# EAGLE design usb2cmi (EAGLE 6.5.0)

## Sheet 1 of 6
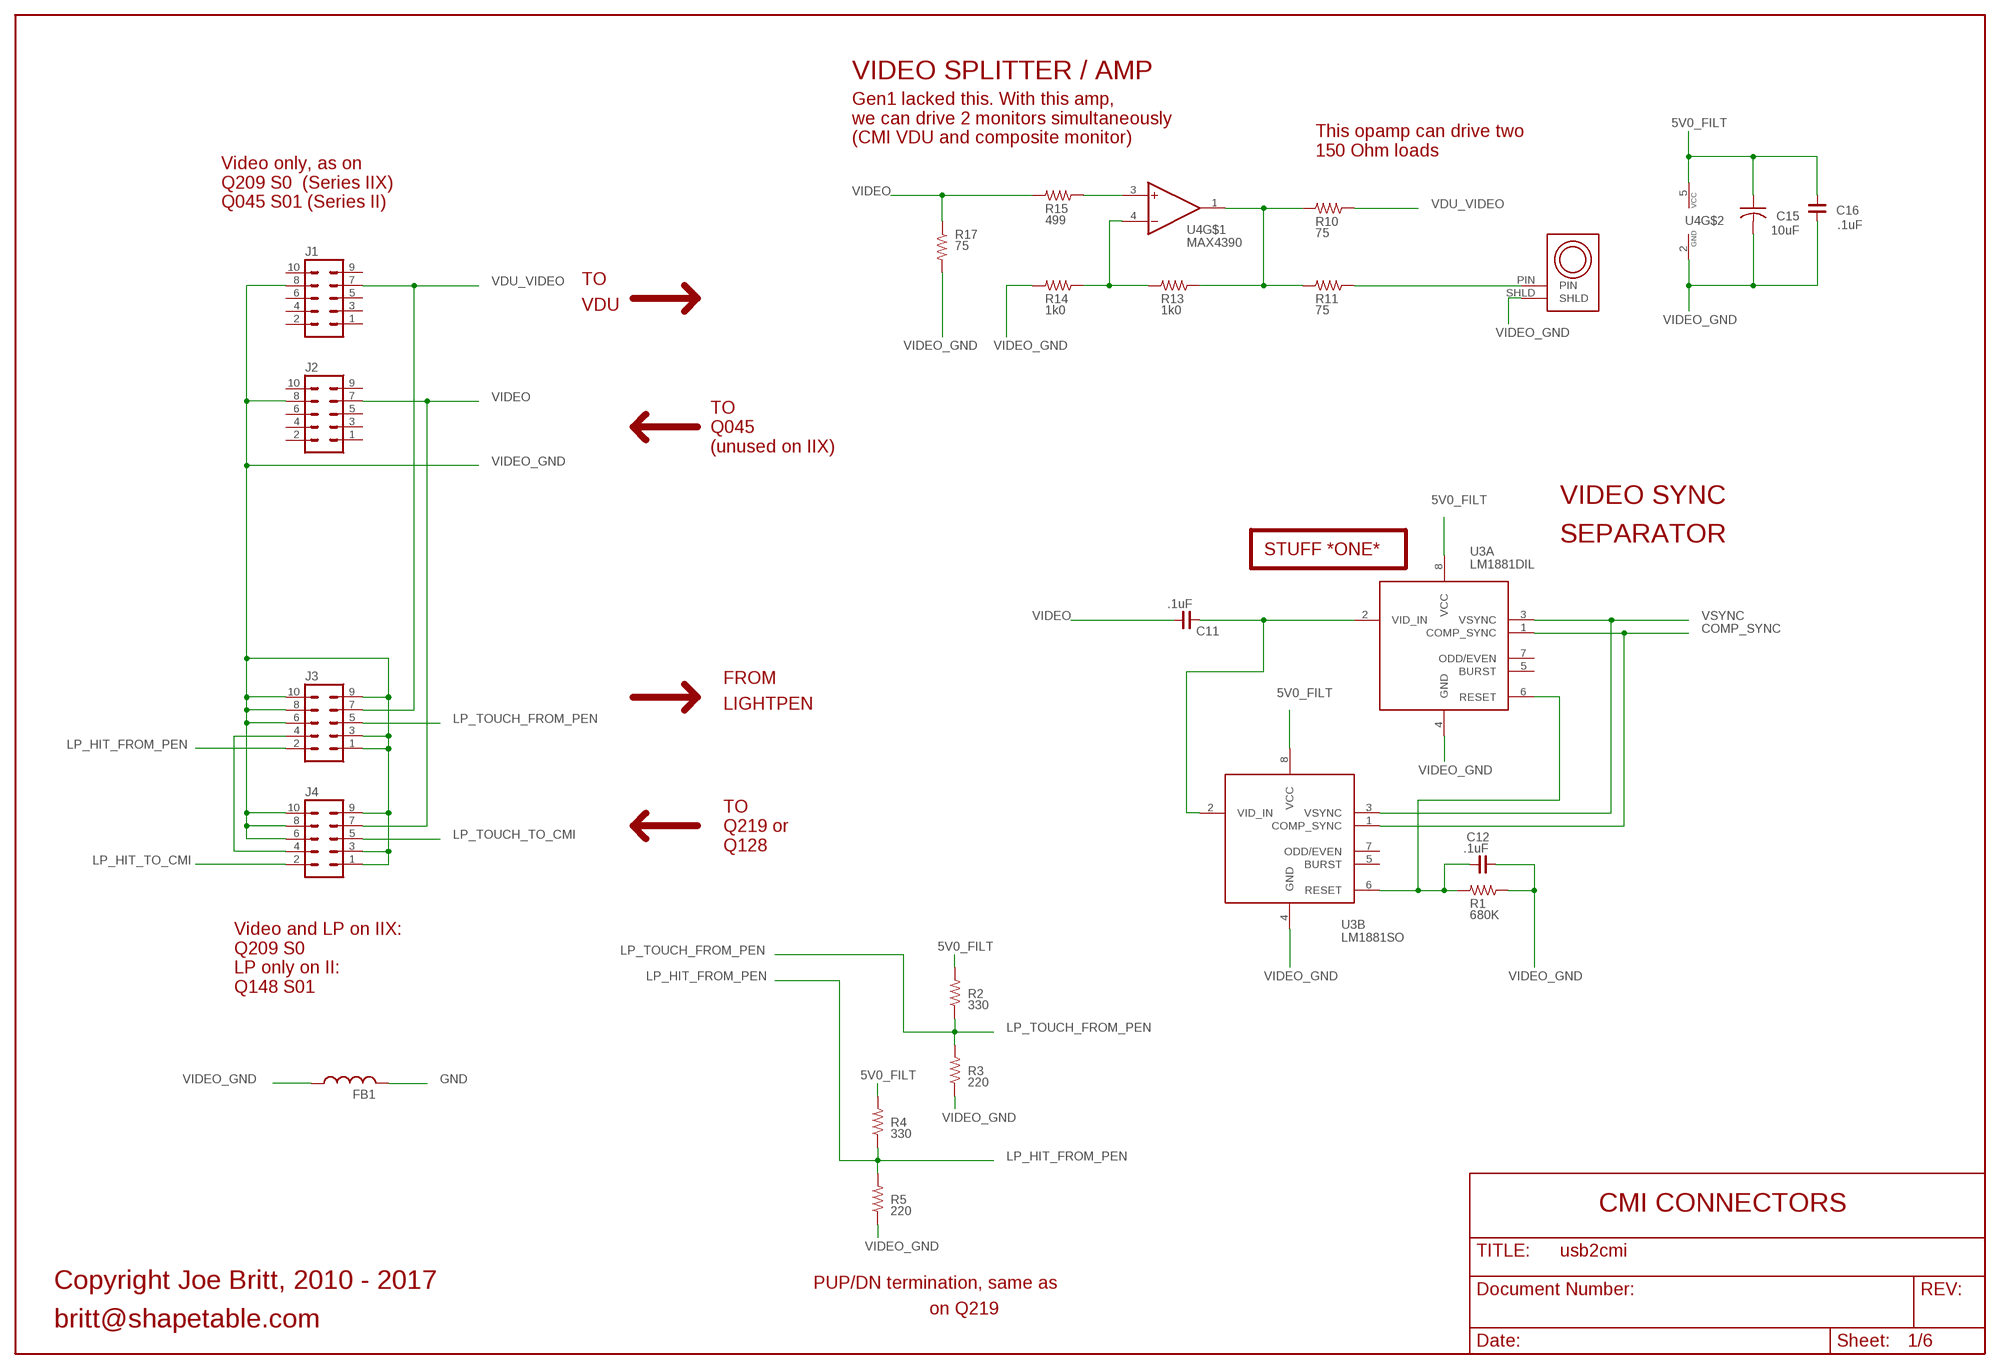
[diagram p0: schematic, sheet 1]

### Parts
C11  .1uF  C_0603  [C0603]
C12  .1uF  C_0603  [C0603]
C15  10uF  C-USC0805  [C0805]
C16  .1uF  C_0603  [C0603]
FB1  L-US0207/15  [0207/15]
J1  10H  [10H]
J2  ML10  [ML10]
J3  10H  [10H]
J4  ML10  [ML10]
J8  CUI RCJ-044  RCA-HSC  [RCA-SHIELDED]
R1  680K  R_0603  [R0603]
R2  330  R_0603  [R0603]
R3  220  R_0603  [R0603]
R4  330  R_0603  [R0603]
R5  220  R_0603  [R0603]
R10  75  R_0603  [R0603]
R11  75  R_0603  [R0603]
R13  1k0  R_0603  [R0603]
R14  1k0  R_0603  [R0603]
R15  499  R_0603  [R0603]
R17  75  R_0603  [R0603]
U3A  LM1881DIL  [DIL08]
U3B  LM1881SO  [SO08]
U4  MAX4390  [SOT23-5L]

### Nets
5V0_FILT: C15.1 C16.2 R2.2 R4.2 U3A.8(VCC) U3B.8(VCC) U4.5(VCC) ; also sheet 2,3,5,6
COMP_SYNC: U3A.1(COMP_SYNC) U3B.1(COMP_SYNC) ; also sheet 2
GND: FB1.2 ; also sheet 2,3,5,6
LP_HIT_FROM_PEN: J3.2 R4.1 R5.2 ; also sheet 2
LP_HIT_TO_CMI: J4.2 ; also sheet 2
LP_TOUCH_FROM_PEN: J3.5 R2.1 R3.2 ; also sheet 2
LP_TOUCH_TO_CMI: J4.5 ; also sheet 2
N$3: J3.4 J4.4
N$4: C11.2 U3A.2(VID_IN) U3B.2(VID_IN)
N$6: C12.1 R1.2 U3A.6(RESET) U3B.6(RESET)
N$17: R10.2 R11.2 R13.1 U4.1(OUT)
N$33: J8.PIN R11.1
N$35: R13.2 R14.1 U4.4(-IN)
N$37: R15.1 U4.3(+IN)
VDU_VIDEO: J1.7 J3.7 R10.1
VIDEO: C11.1 J2.7 J4.7 R15.2 R17.1
VIDEO_GND: C12.2 C15.2 C16.1 FB1.1 J1.8 J2.8 J3.1 J3.3 J3.6 J3.8 J3.9 J3.10 J4.1 J4.3 J4.6 J4.8 J4.9 J4.10 J8.SHLD R1.1 R3.1 R5.1 R14.2 R17.2 U3A.4(GND) U3B.4(GND) U4.2(GND) ; also sheet 3
VSYNC: U3A.3(VSYNC) U3B.3(VSYNC) ; also sheet 2
Unconnected: J1.1 J1.2 J1.3 J1.4 J1.5 J1.6 J1.9 J1.10 J2.1 J2.2 J2.3 J2.4 J2.5 J2.6 J2.9 J2.10 J8.FRM1 J8.FRM2 U3A.5(BURST) U3A.7(ODD/EVEN) U3B.5(BURST) U3B.7(ODD/EVEN)

### Notes on the sheet
- VIDEO SPLITTER / AMP
- Gen1 lacked this. With this amp,
  we can drive 2 monitors simultaneously
  (CMI VDU and composite monitor)
- This opamp can drive two
  150 Ohm loads
- Video only, as on
  Q209 S0  (Series IIX)
  Q045 S01 (Series II)
- TO
- VDU
- TO
- Q045
  (unused on IIX)
- VIDEO SYNC
- SEPARATOR
- STUFF *ONE*
- FROM
- LIGHTPEN
- TO
- Q219 or
  Q128
- Video and LP on IIX:
  Q209 S0
  LP only on II:
  Q148 S01
- CMI CONNECTORS
- Copyright Joe Britt, 2010 - 2017 | PUP/DN termination, same as
- on Q219
- britt@shapetable.com

## Sheet 2 of 6
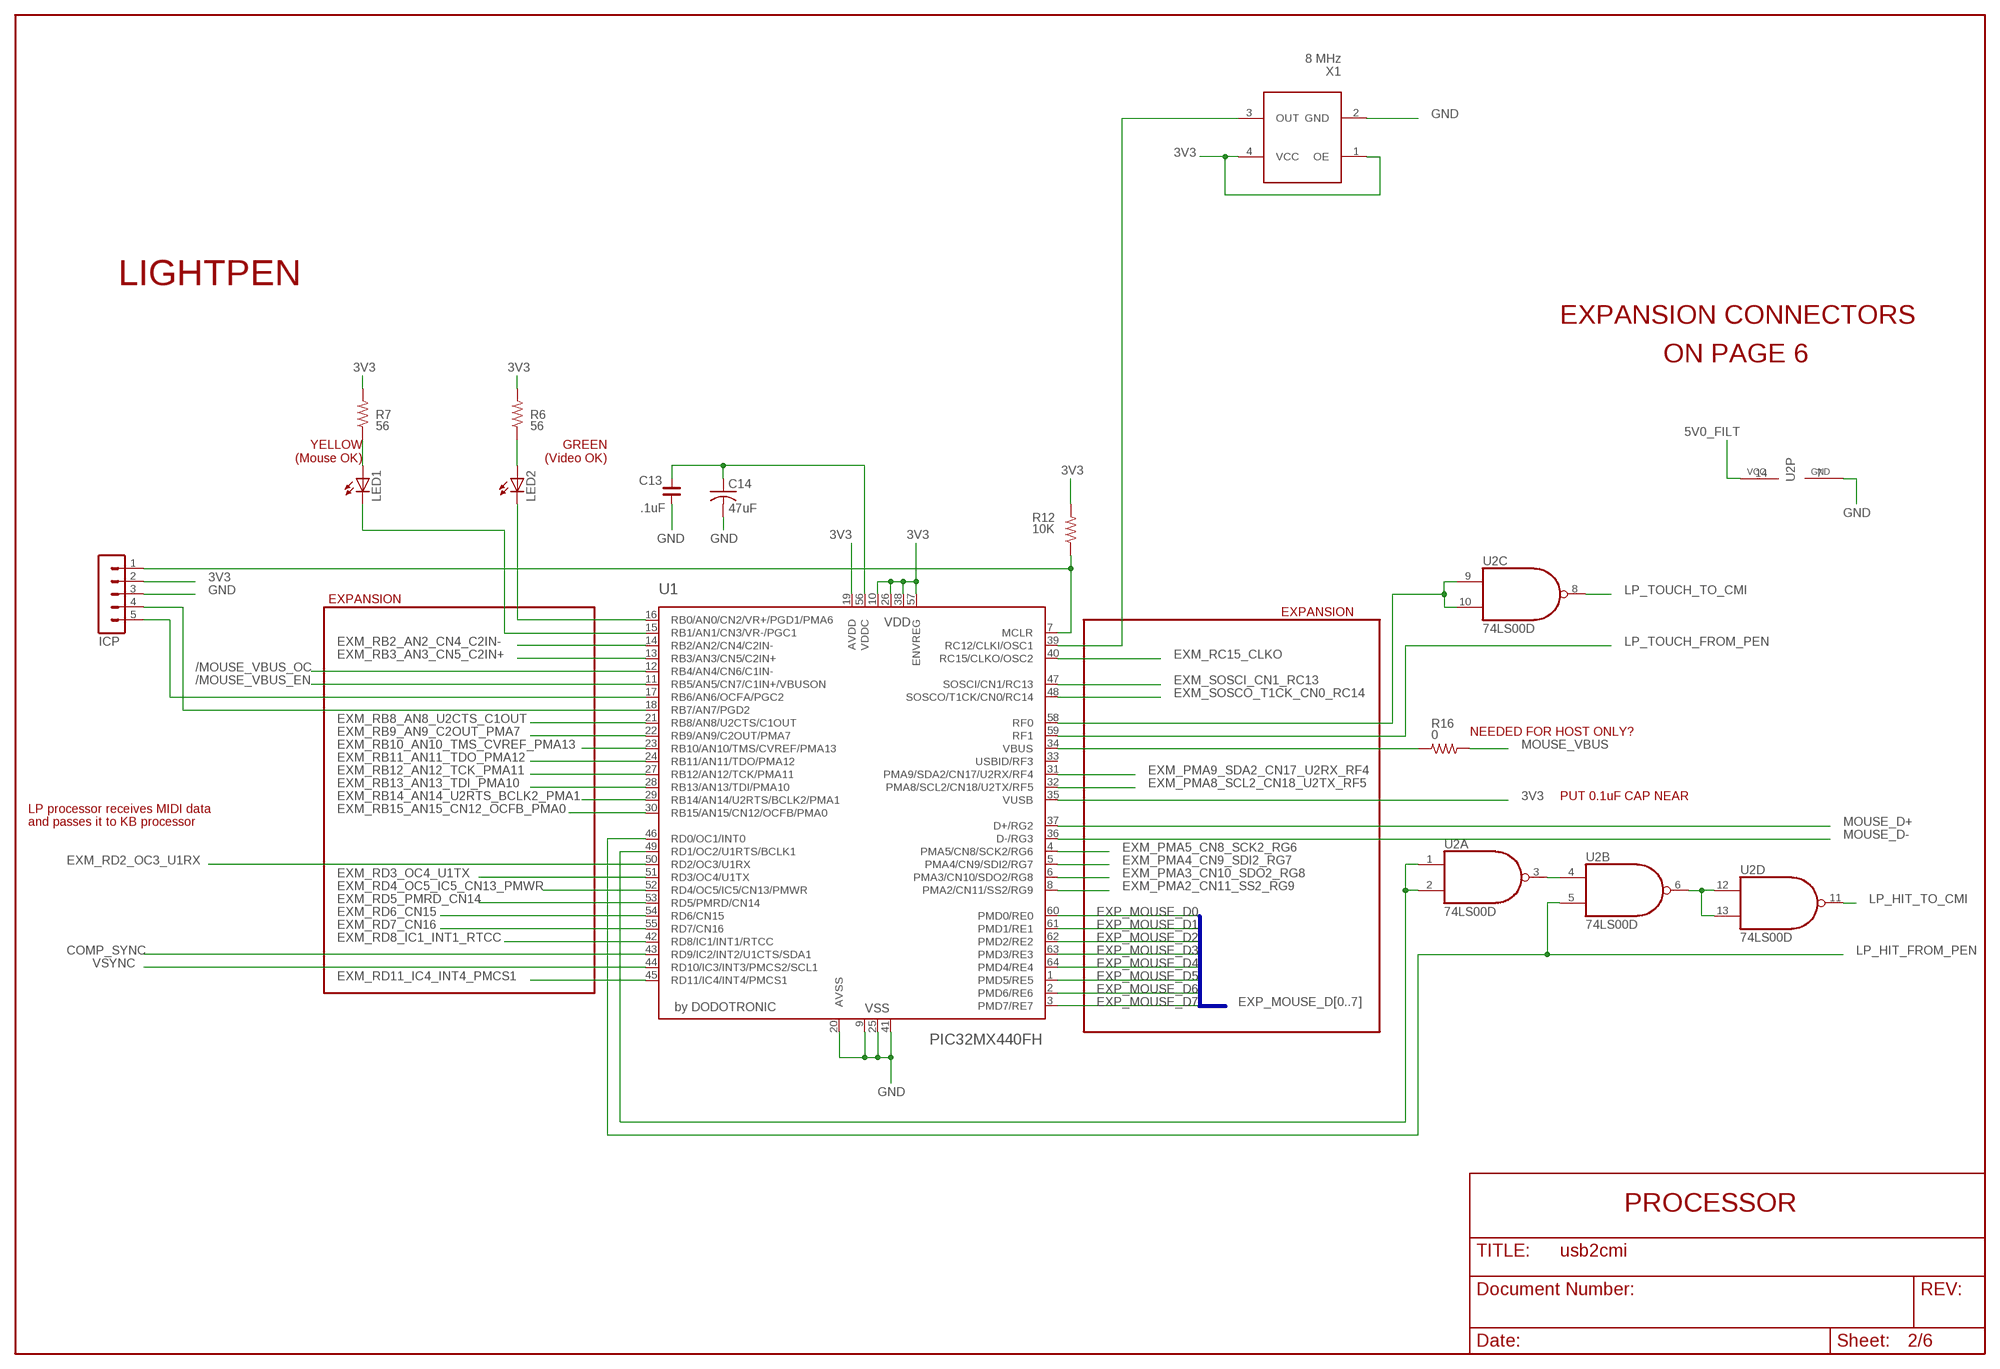
[diagram p1: schematic, sheet 2]

### Parts
C13  .1uF  C_0603  [C0603]
C14  47uF  C-USC0805  [C0805]
ICP  MA05-1  [MA05-1]
LED1  LEDCHIPLED_0805  [CHIPLED_0805]
LED2  LEDCHIPLED_0805  [CHIPLED_0805]
R6  56  R_0603  [R0603]
R7  56  R_0603  [R0603]
R12  10K  R_0603  [R0603]
R16  0  R_0603  [R0603]
U1  PIC32MX440FH  [TQFP64-10X10]
U2  74LS00D  [SO14]
X1  8 MHz  CTS-OSC  [CTS-OSC]

### Nets
3V3: ICP.2 R6.2 R7.2 R12.2 U1.10(VDD) U1.19(AVDD) U1.26(VDD) U1.35(VUSB) U1.38(VDD) U1.57(ENVREG) X1.1(OE) X1.4(VCC) ; also sheet 3
5V0_FILT: U2.14(P:VCC) ; also sheet 1,3,5,6
/MOUSE_VBUS_EN: U1.11(RB5/AN5/CN7/C1IN+/VBUSON) ; also sheet 5
/MOUSE_VBUS_OC: U1.12(RB4/AN4/CN6/C1IN-) ; also sheet 5
COMP_SYNC: U1.43(RD9/IC2/INT2/U1CTS/SDA1) ; also sheet 1
EXM_PMA2_CN11_SS2_RG9: U1.8(PMA2/CN11/SS2/RG9)
EXM_PMA3_CN10_SDO2_RG8: U1.6(PMA3/CN10/SDO2/RG8)
EXM_PMA4_CN9_SDI2_RG7: U1.5(PMA4/CN9/SDI2/RG7)
EXM_PMA5_CN8_SCK2_RG6: U1.4(PMA5/CN8/SCK2/RG6)
EXM_PMA8_SCL2_CN18_U2TX_RF5: U1.32(PMA8/SCL2/CN18/U2TX/RF5) ; also sheet 6
EXM_PMA9_SDA2_CN17_U2RX_RF4: U1.31(PMA9/SDA2/CN17/U2RX/RF4) ; also sheet 6
EXM_RB0_AN0_CN2_PMA6: LED2.C U1.16(RB0/AN0/CN2/VR+/PGD1/PMA6)
EXM_RB2_AN2_CN4_C2IN-: U1.14(RB2/AN2/CN4/C2IN-)
EXM_RB3_AN3_CN5_C2IN+: U1.13(RB3/AN3/CN5/C2IN+)
EXM_RB8_AN8_U2CTS_C1OUT: U1.21(RB8/AN8/U2CTS/C1OUT)
EXM_RB9_AN9_C2OUT_PMA7: U1.22(RB9/AN9/C2OUT/PMA7)
EXM_RB10_AN10_TMS_CVREF_PMA13: U1.23(RB10/AN10/TMS/CVREF/PMA13)
EXM_RB11_AN11_TDO_PMA12: U1.24(RB11/AN11/TDO/PMA12)
EXM_RB12_AN12_TCK_PMA11: U1.27(RB12/AN12/TCK/PMA11)
EXM_RB13_AN13_TDI_PMA10: U1.28(RB13/AN13/TDI/PMA10)
EXM_RB14_AN14_U2RTS_BCLK2_PMA1: U1.29(RB14/AN14/U2RTS/BCLK2/PMA1)
EXM_RB15_AN15_CN12_OCFB_PMA0: U1.30(RB15/AN15/CN12/OCFB/PMA0)
EXM_RC15_CLKO: U1.40(RC15/CLKO/OSC2)
EXM_RD2_OC3_U1RX: U1.50(RD2/OC3/U1RX) ; also sheet 6
EXM_RD3_OC4_U1TX: U1.51(RD3/OC4/U1TX) ; also sheet 6
EXM_RD4_OC5_IC5_CN13_PMWR: U1.52(RD4/OC5/IC5/CN13/PMWR)
EXM_RD5_PMRD_CN14: U1.53(RD5/PMRD/CN14)
EXM_RD6_CN15: U1.54(RD6/CN15)
EXM_RD7_CN16: U1.55(RD7/CN16)
EXM_RD8_IC1_INT1_RTCC: U1.42(RD8/IC1/INT1/RTCC)
EXM_RD11_IC4_INT4_PMCS1: U1.45(RD11/IC4/INT4/PMCS1)
EXM_SOSCI_CN1_RC13: U1.47(SOSCI/CN1/RC13)
EXM_SOSCO_T1CK_CN0_RC14: U1.48(SOSCO/T1CK/CN0/RC14)
EXP_MOUSE_D0: U1.60(PMD0/RE0)
EXP_MOUSE_D1: U1.61(PMD1/RE1)
EXP_MOUSE_D2: U1.62(PMD2/RE2)
EXP_MOUSE_D3: U1.63(PMD3/RE3)
EXP_MOUSE_D4: U1.64(PMD4/RE4)
EXP_MOUSE_D5: U1.1(PMD5/RE5)
EXP_MOUSE_D6: U1.2(PMD6/RE6)
EXP_MOUSE_D7: U1.3(PMD7/RE7)
GND: C13.2 C14.2 ICP.3 U1.9(VSS) U1.20(AVSS) U1.25(VSS) U1.41(VSS) U2.7(P:GND) X1.2(GND) ; also sheet 1,3,5,6
LP_HIT_FROM_PEN: U1.46(RD0/OC1/INT0) U2.5(B:I1) ; also sheet 1
LP_HIT_TO_CMI: U2.11(D:O) ; also sheet 1
LP_TOUCH_FROM_PEN: U1.59(RF1) ; also sheet 1
LP_TOUCH_TO_CMI: U2.8(C:O) ; also sheet 1
MOUSE_D+: U1.37(D+/RG2) ; also sheet 5
MOUSE_D-: U1.36(D-/RG3) ; also sheet 5
MOUSE_VBUS: R16.1 ; also sheet 5
N$1: C13.1 C14.1 U1.56(VDDC)
N$2: LED2.A R6.1
N$5: LED1.C U1.15(RB1/AN1/CN3/VR-/PGC1)
N$16: U1.39(RC12/CLKI/OSC1) X1.3(OUT)
N$27: U1.58(RF0) U2.9(C:I0) U2.10(C:I1)
N$29: U2.6(B:O) U2.12(D:I0) U2.13(D:I1)
N$30: U2.3(A:O) U2.4(B:I0)
N$31: U1.49(RD1/OC2/U1RTS/BCLK1) U2.1(A:I0) U2.2(A:I1)
N$34: LED1.A R7.1
N$36: R16.2 U1.34(VBUS)
PGC: ICP.5 U1.17(RB6/AN6/OCFA/PGC2)
PGD: ICP.4 U1.18(RB7/AN7/PGD2)
U2_MCLR: ICP.1 R12.1 U1.7(MCLR)
VSYNC: U1.44(RD10/IC3/INT3/PMCS2/SCL1) ; also sheet 1
Unconnected: U1.33(USBID/RF3)

### Buses
EXP_MOUSE_D[0..7]

### Notes on the sheet
- LIGHTPEN
- EXPANSION CONNECTORS
- ON PAGE 6
- YELLOW
  (Mouse OK)
- GREEN
  (Video OK)
- EXPANSION
- EXPANSION
- NEEDED FOR HOST ONLY?
- PUT 0.1uF CAP NEAR
- LP processor receives MIDI data
- and passes it to KB processor
- PROCESSOR

## Sheet 3 of 6
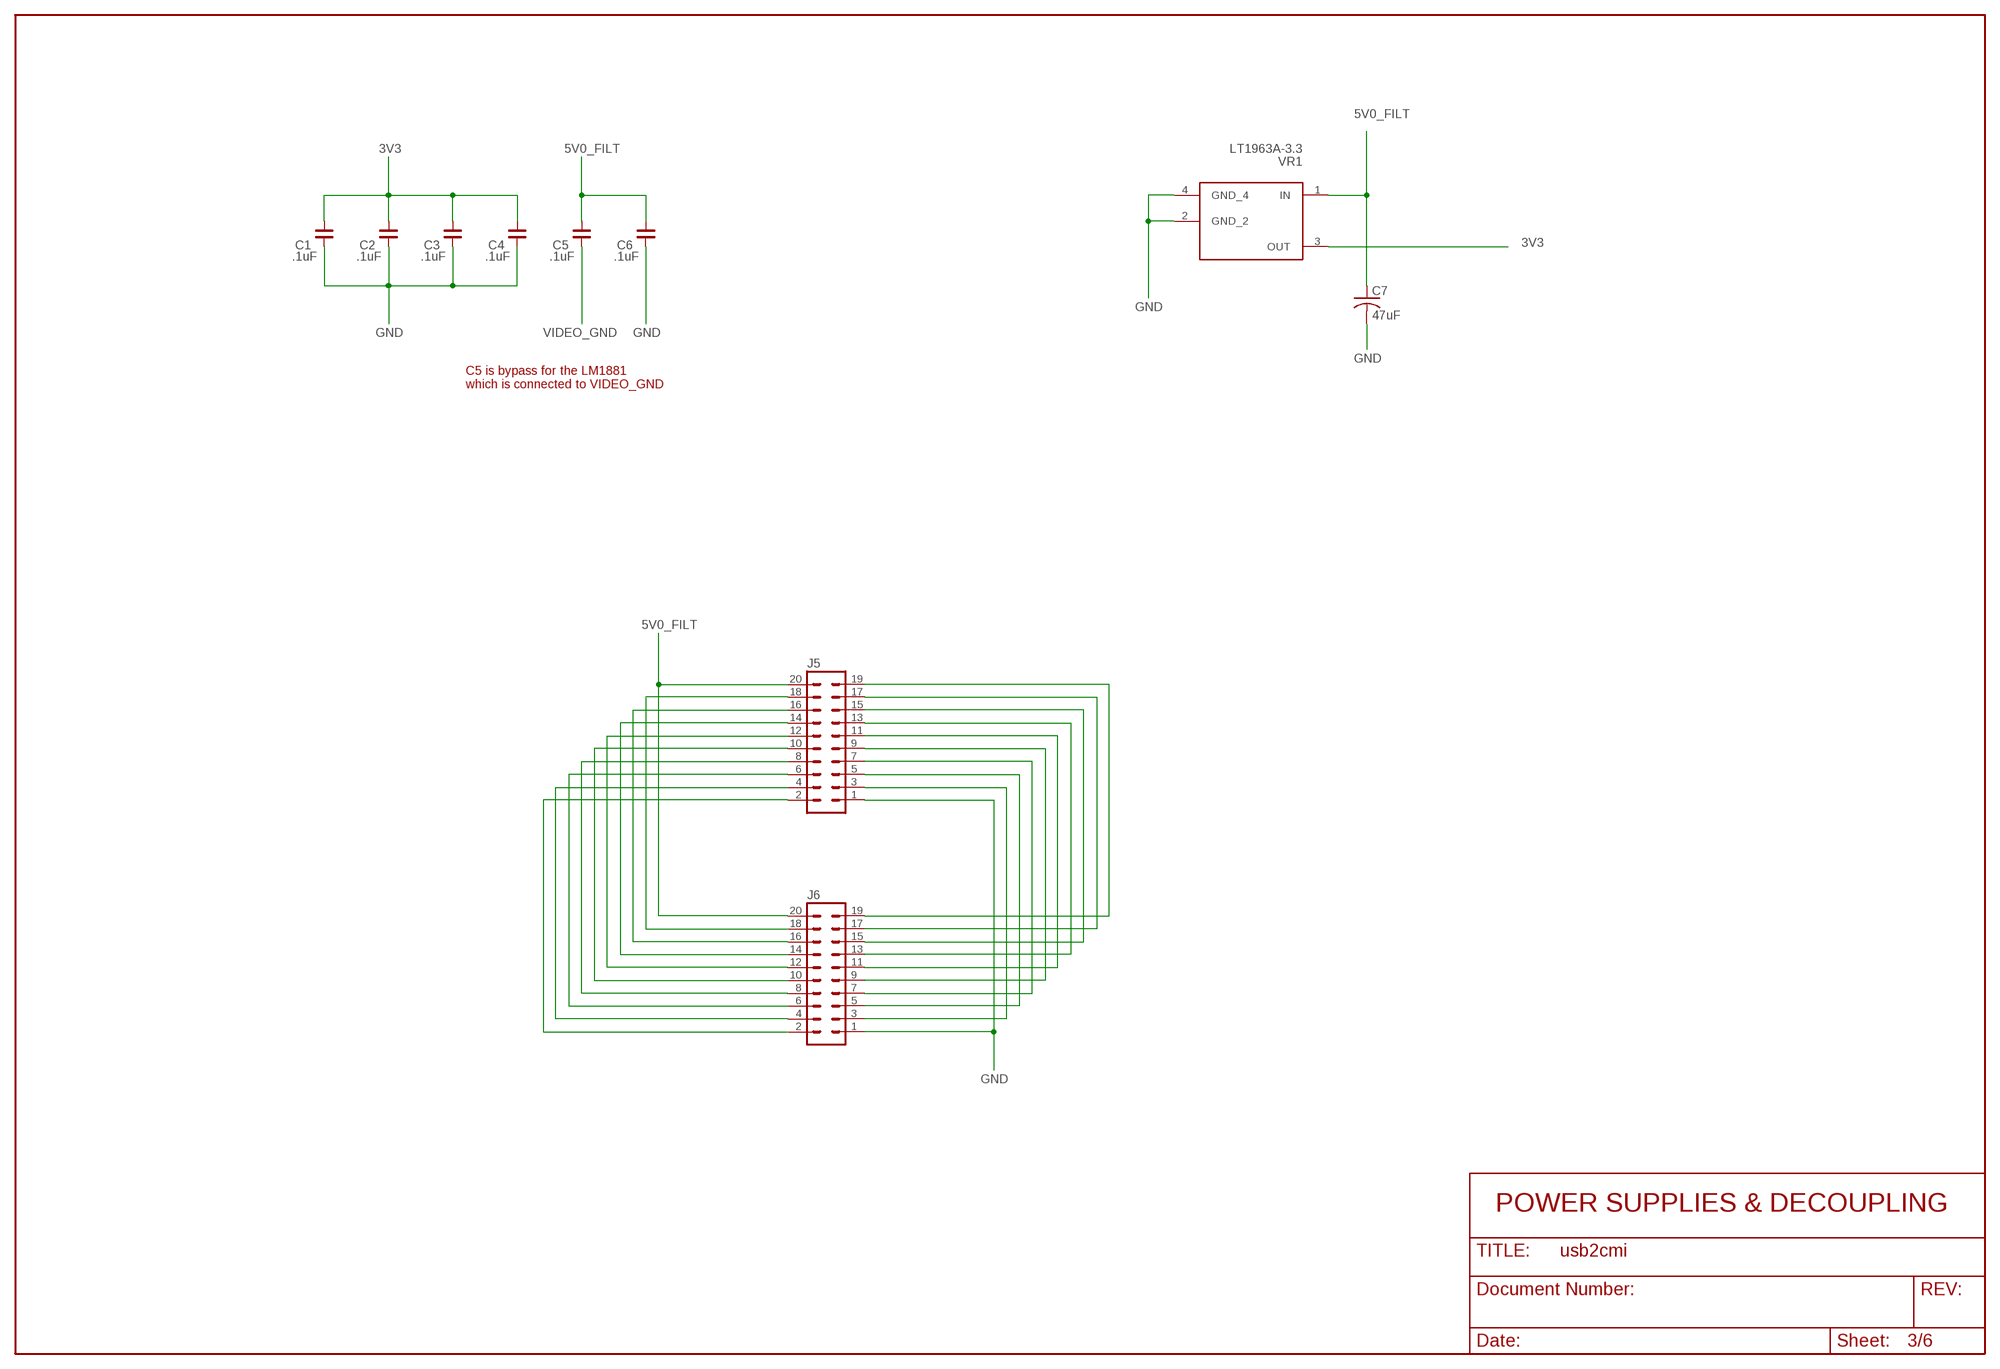
[diagram p2: schematic, sheet 3]

### Parts
C1  .1uF  C_0603  [C0603]
C2  .1uF  C_0603  [C0603]
C3  .1uF  C_0603  [C0603]
C4  .1uF  C_0603  [C0603]
C5  .1uF  C_0603  [C0603]
C6  .1uF  C_0603  [C0603]
C7  47uF  C-USC0805  [C0805]
J5  20H  [20H]
J6  ML20  [ML20]
VR1  LT1963A-3.3  LINEAR-REG-SOT223  [SOT-223]

### Nets
3V3: C1.1 C2.1 C3.1 C4.1 VR1.3(OUT) ; also sheet 2
5V0_FILT: C5.1 C6.1 C7.1 J5.20 J6.20 VR1.1(IN) ; also sheet 1,2,5,6
GND: C1.2 C2.2 C3.2 C4.2 C6.2 C7.2 J5.1 J6.1 VR1.2(GND_2) VR1.4(GND_4) ; also sheet 1,2,5,6
N$7: J5.18 J6.18
N$8: J5.16 J6.16
N$9: J5.14 J6.14
N$10: J5.12 J6.12
N$11: J5.10 J6.10
N$12: J5.8 J6.8
N$13: J5.6 J6.6
N$14: J5.4 J6.4
N$15: J5.2 J6.2
N$18: J5.3 J6.3
N$19: J5.5 J6.5
N$20: J5.7 J6.7
N$21: J5.9 J6.9
N$22: J5.11 J6.11
N$23: J5.13 J6.13
N$24: J5.15 J6.15
N$28: J5.17 J6.17
N$32: J5.19 J6.19
VIDEO_GND: C5.2 ; also sheet 1

### Notes on the sheet
- C5 is bypass for the LM1881
  which is connected to VIDEO_GND
- POWER SUPPLIES & DECOUPLING

## Sheet 4 of 6
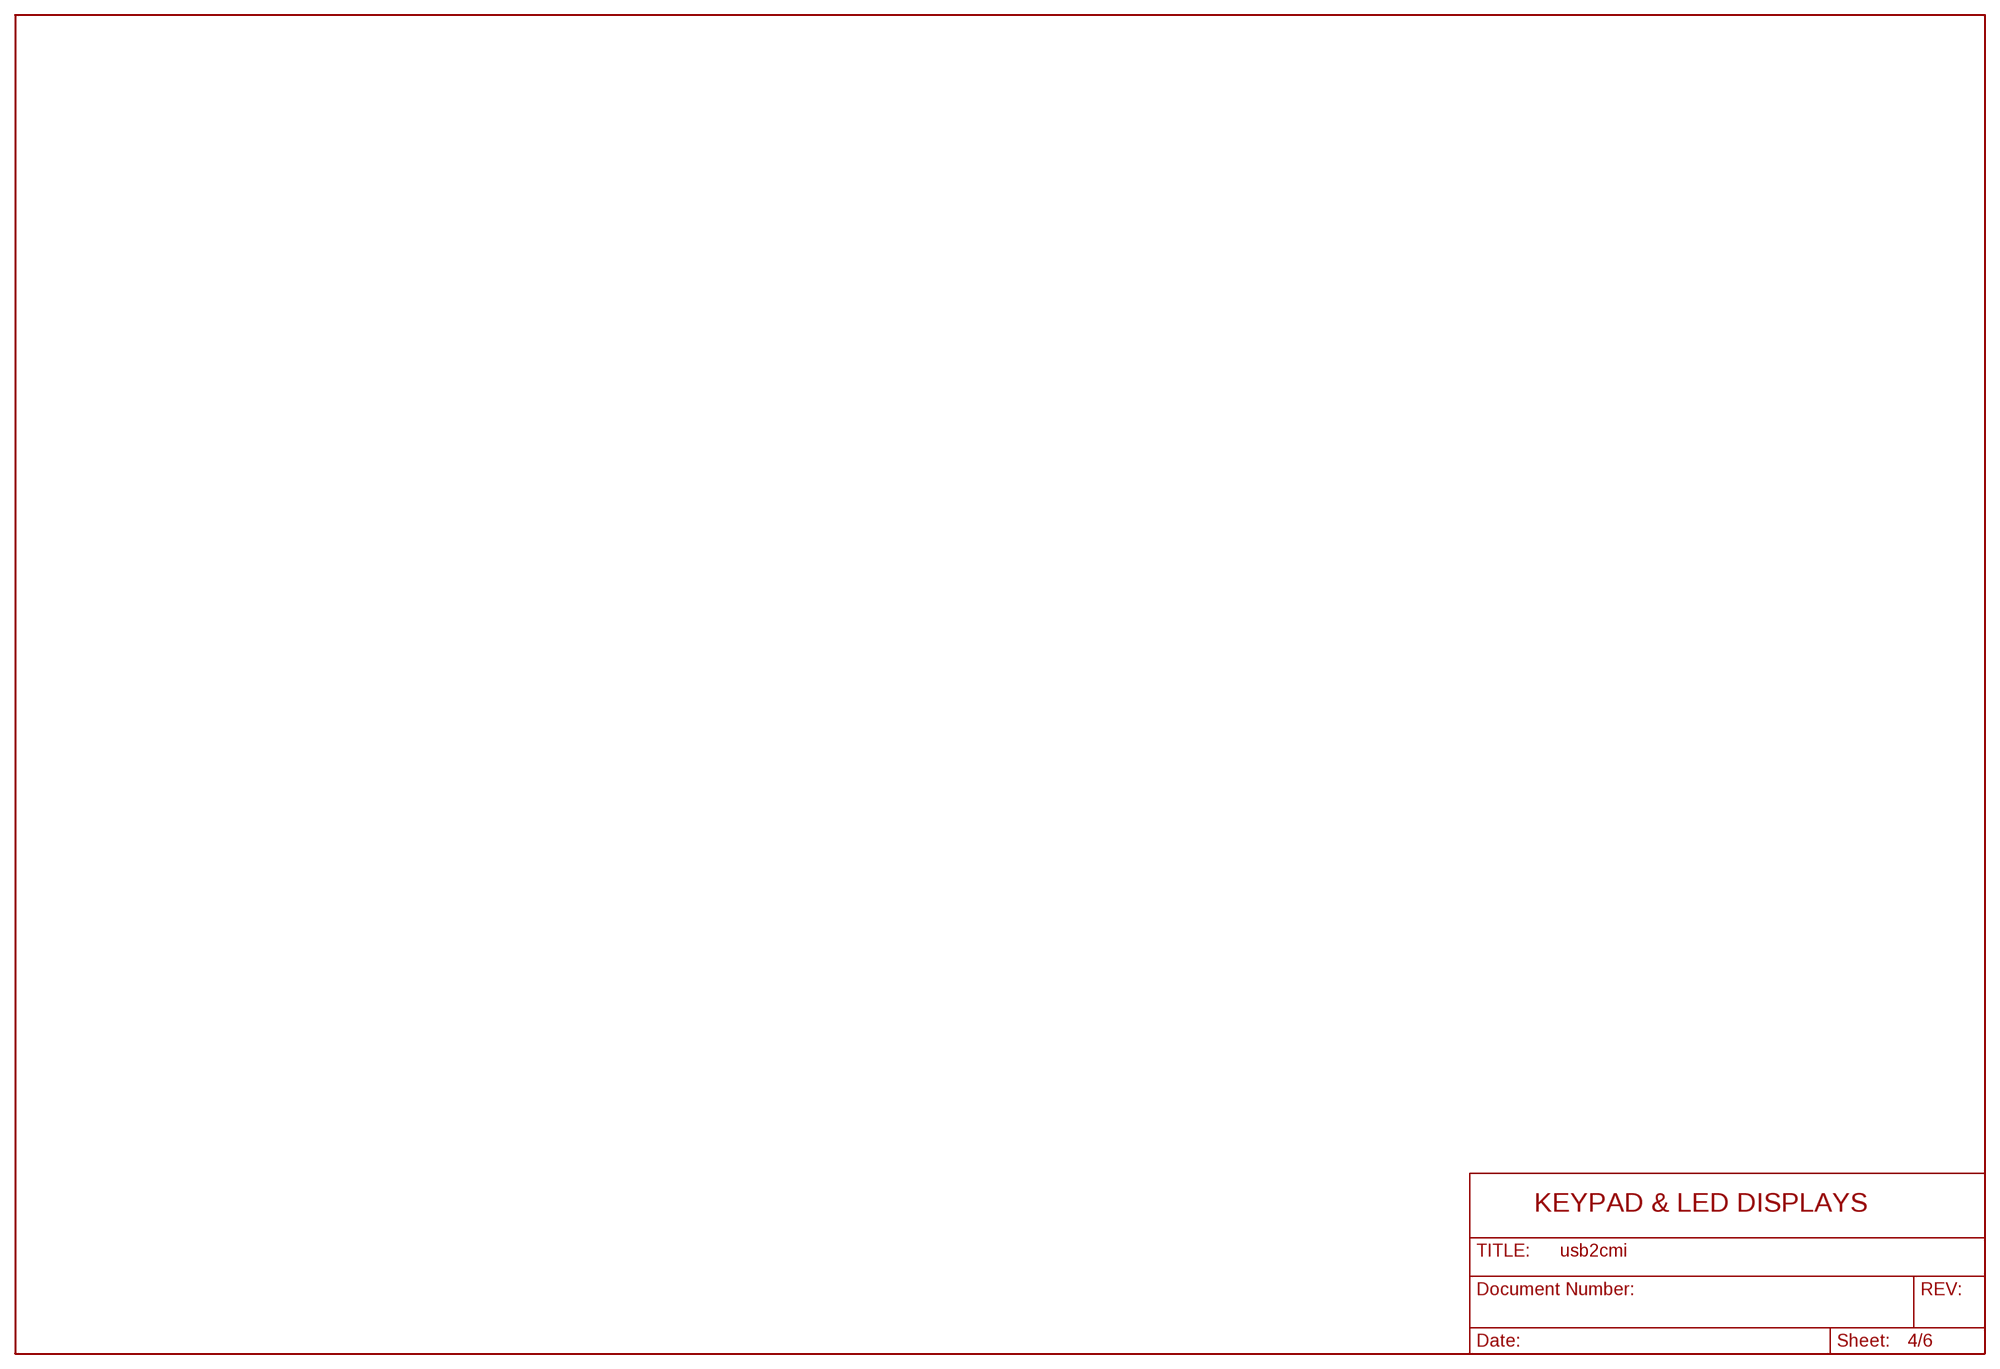
[diagram p3: schematic, sheet 4]

### Notes on the sheet
- KEYPAD & LED DISPLAYS

## Sheet 5 of 6
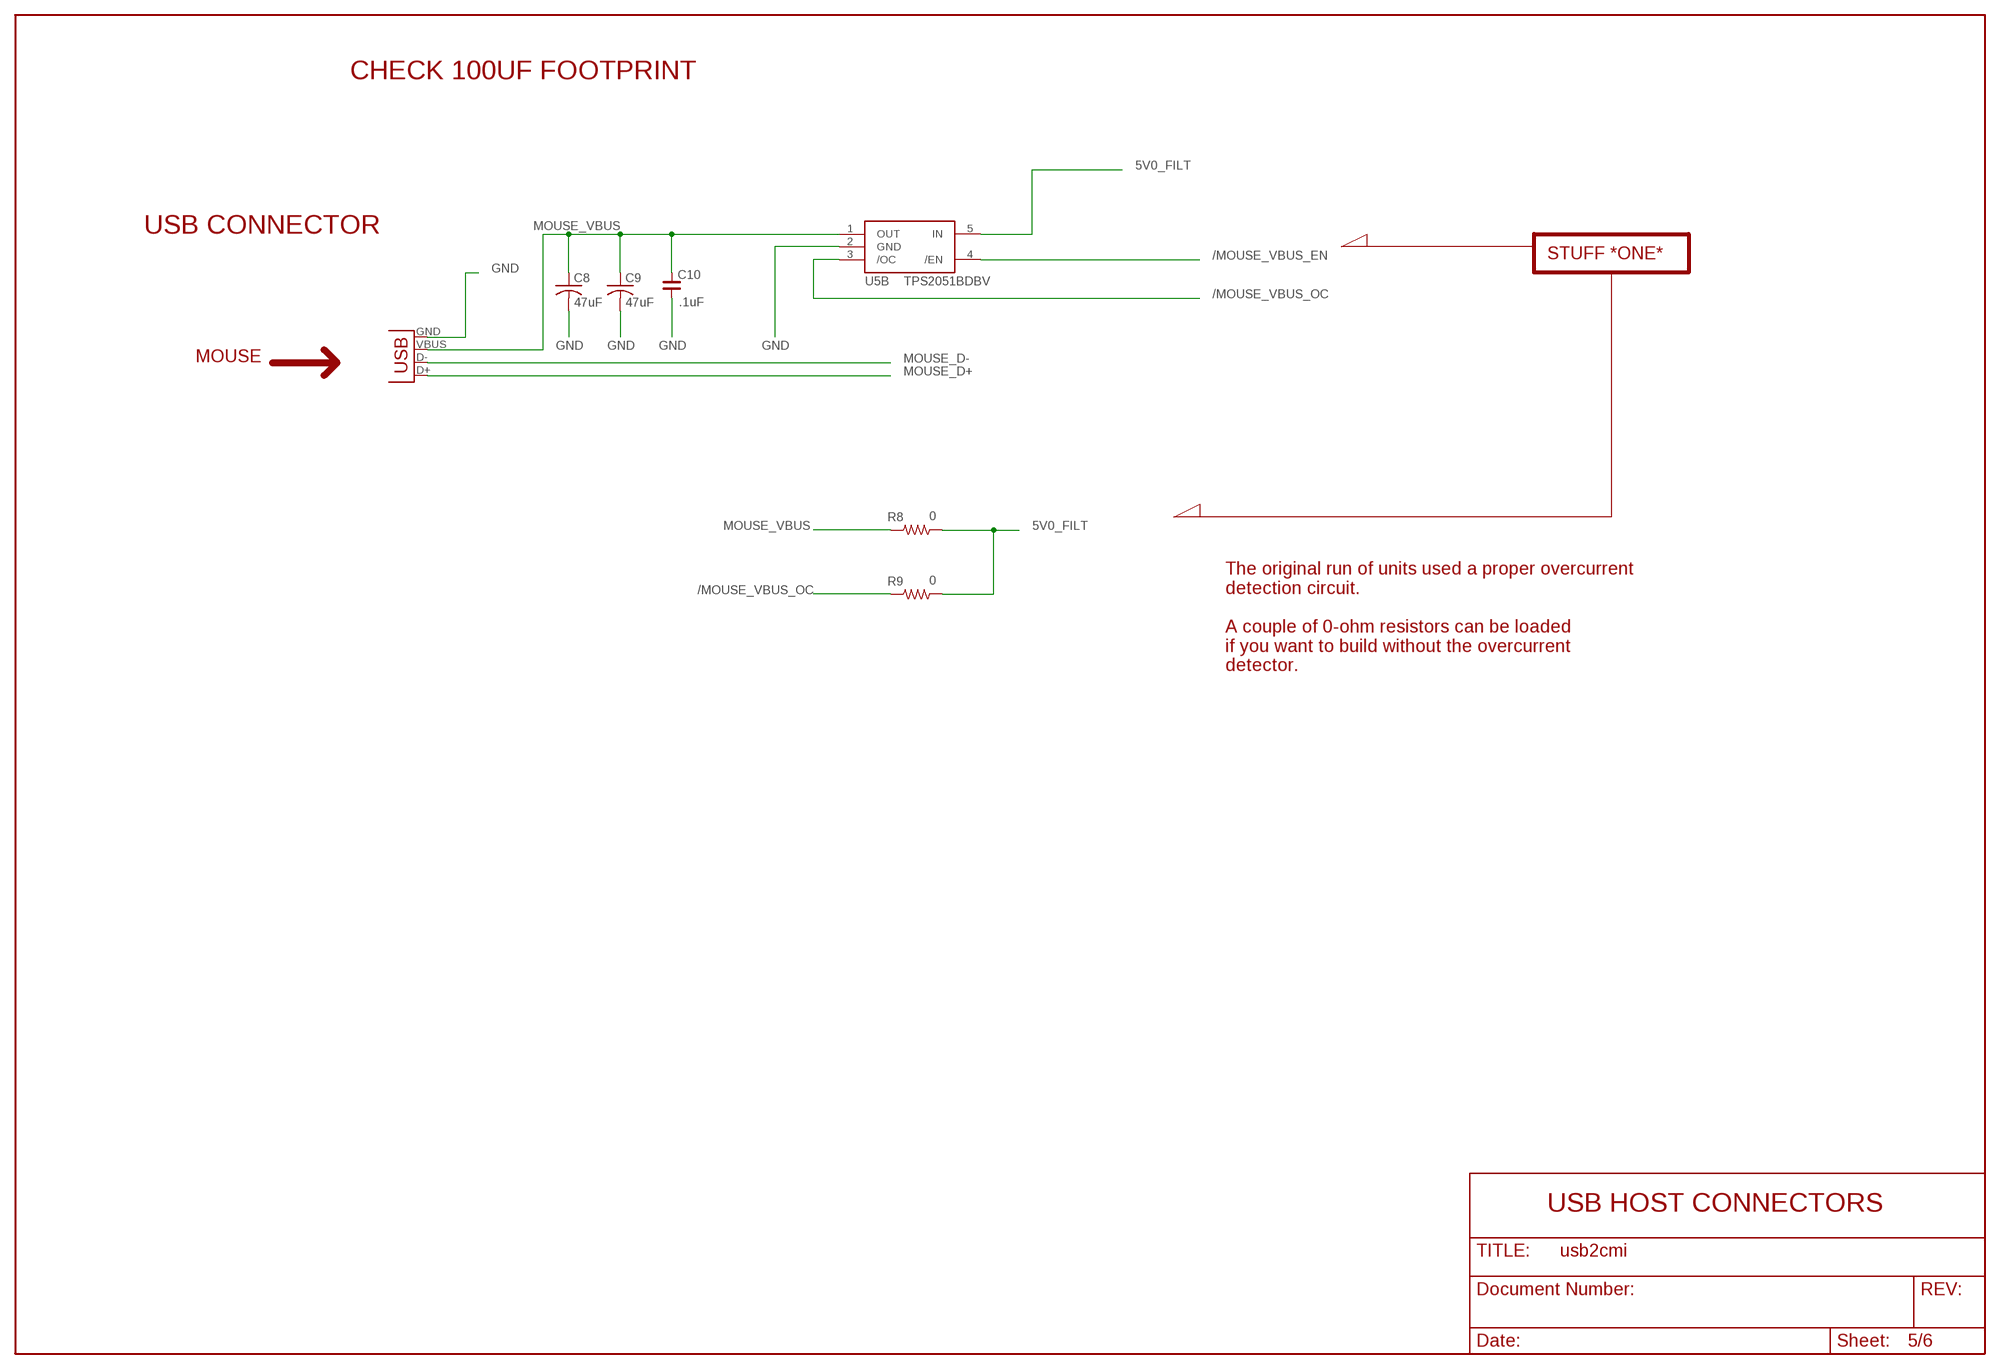
[diagram p4: schematic, sheet 5]

### Parts
C8  47uF  C-USC0805  [C0805]
C9  47uF  C-USC0805  [C0805]
C10  .1uF  C_0603  [C0603]
J7  USB-A-H  [USB-A-H]
R8  0  R_0603  [R0603]
R9  0  R_0603  [R0603]
U5B  TPS2051BDBV  TPS2041BDBV  [DBV-5]

### Nets
5V0_FILT: R8.1 R9.1 U5B.5(IN) ; also sheet 1,2,3,6
/MOUSE_VBUS_EN: U5B.4(/EN) ; also sheet 2
/MOUSE_VBUS_OC: R9.2 U5B.3(/OC) ; also sheet 2
GND: C8.2 C9.2 C10.2 J7.GND U5B.2(GND) ; also sheet 1,2,3,6
MOUSE_D+: J7.D+ ; also sheet 2
MOUSE_D-: J7.D- ; also sheet 2
MOUSE_VBUS: C8.1 C9.1 C10.1 J7.VBUS R8.2 U5B.1(OUT) ; also sheet 2

### Notes on the sheet
- CHECK 100UF FOOTPRINT
- USB CONNECTOR
- STUFF *ONE*
- MOUSE
- The original run of units used a proper overcurrent
  detection circuit.
  
  A couple of 0-ohm resistors can be loaded
  if you want to build without the overcurrent
  detector.
- USB HOST CONNECTORS

## Sheet 6 of 6
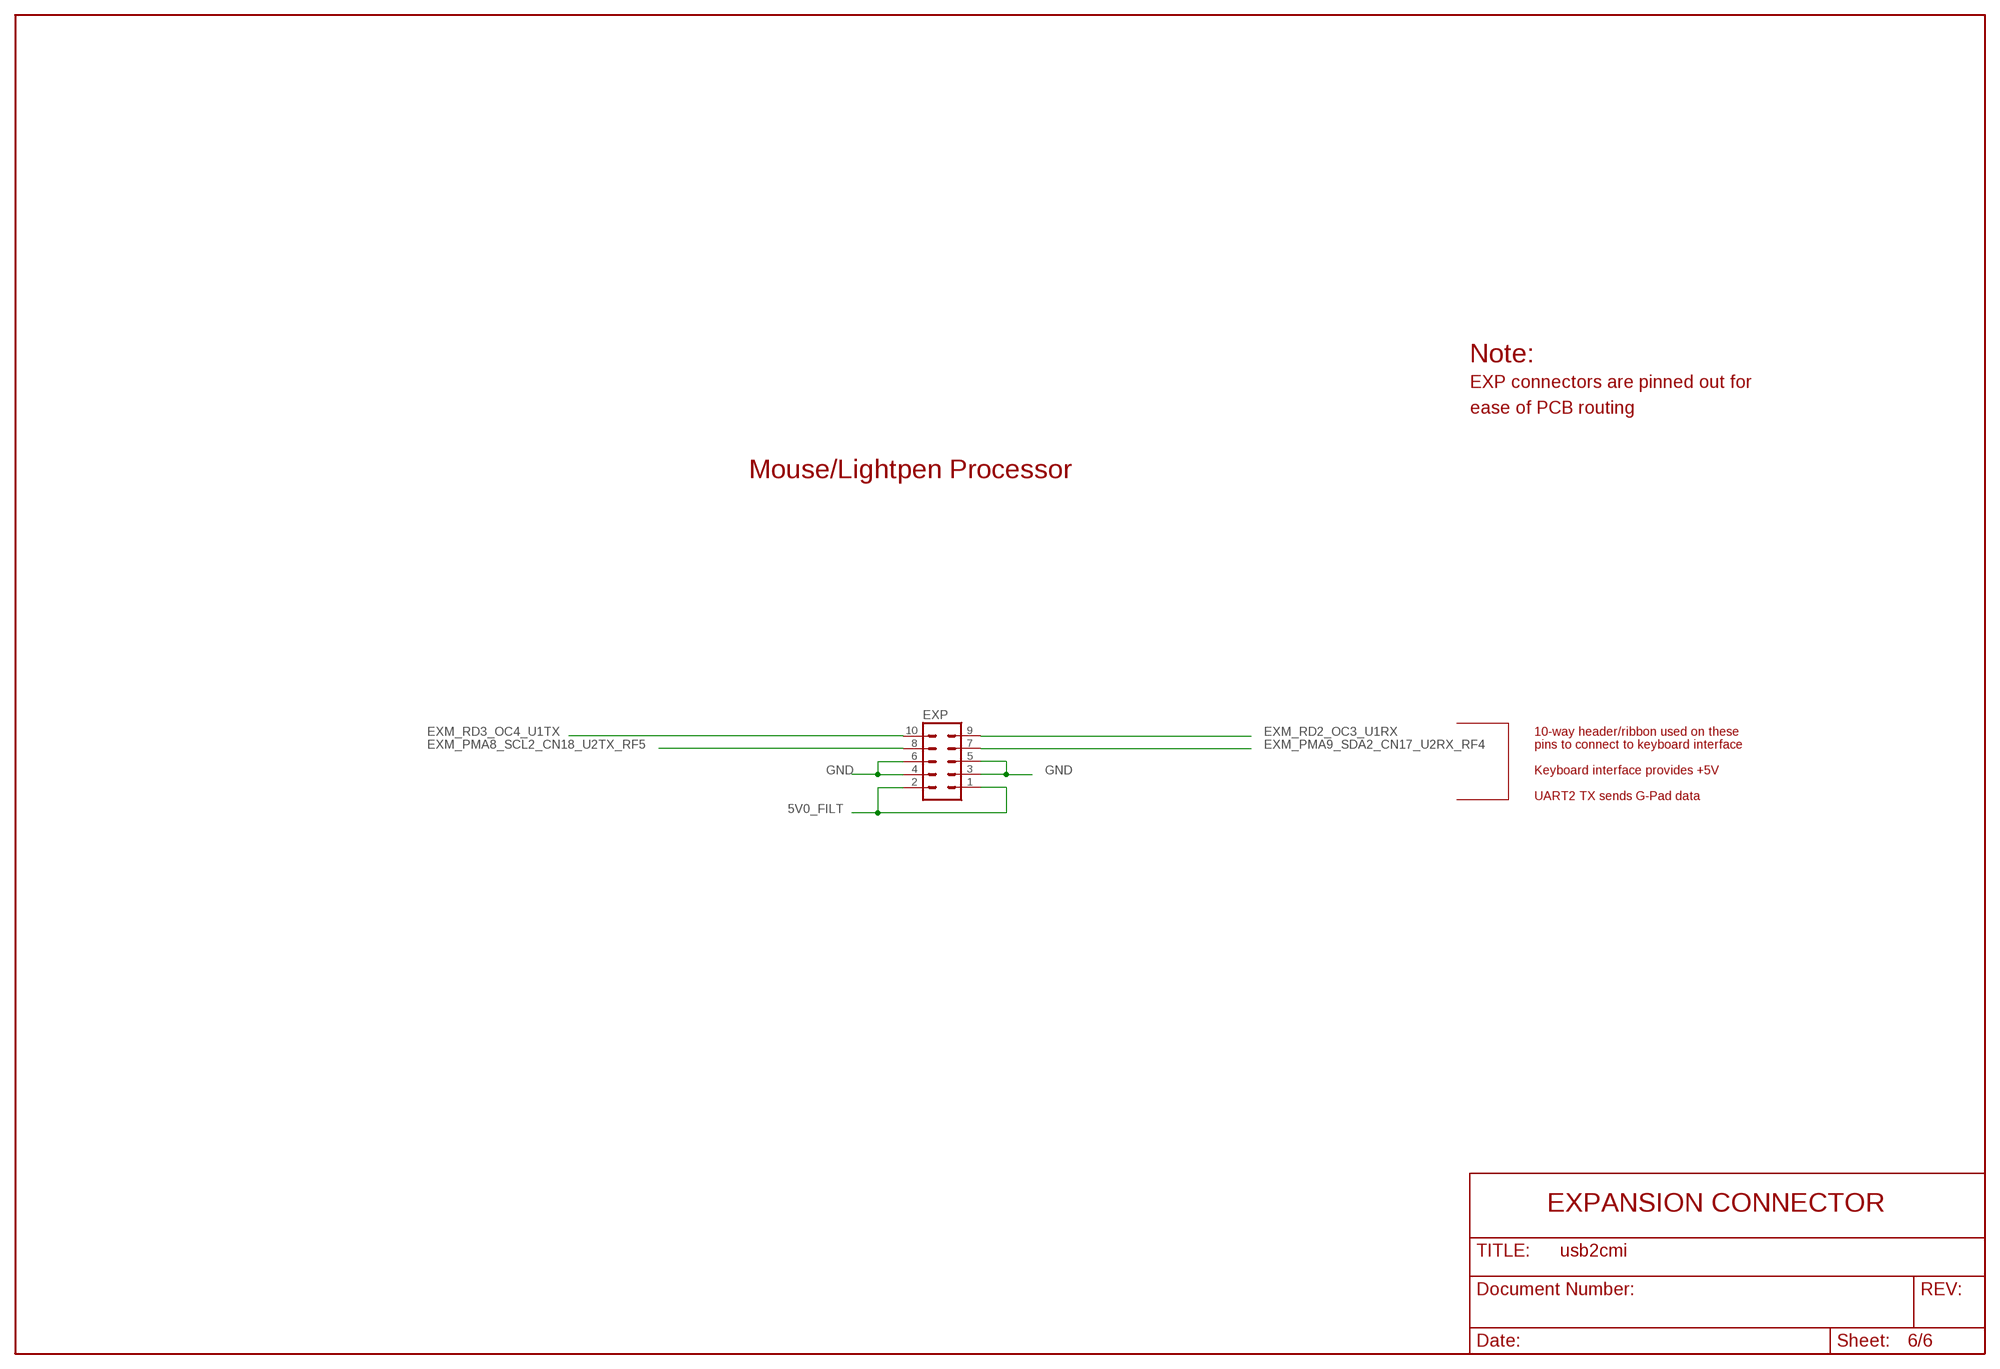
[diagram p5: schematic, sheet 6]

### Parts
EXP  MA05-2  [MA05-2]

### Nets
5V0_FILT: EXP.1 EXP.2 ; also sheet 1,2,3,5
EXM_PMA8_SCL2_CN18_U2TX_RF5: EXP.8 ; also sheet 2
EXM_PMA9_SDA2_CN17_U2RX_RF4: EXP.7 ; also sheet 2
EXM_RD2_OC3_U1RX: EXP.9 ; also sheet 2
EXM_RD3_OC4_U1TX: EXP.10 ; also sheet 2
GND: EXP.3 EXP.4 EXP.5 EXP.6 ; also sheet 1,2,3,5

### Notes on the sheet
- Note:
- EXP connectors are pinned out for
- ease of PCB routing
- Mouse/Lightpen Processor
- 10-way header/ribbon used on these
- pins to connect to keyboard interface
- Keyboard interface provides +5V
- UART2 TX sends G-Pad data
- EXPANSION CONNECTOR

## Library data of the parts
C1-C6 C10-C13 C16 = rc-master-smd:C_: NON-POLARIZED CAP
C7-C9 C14 C15 = rcl:C-US: CAPACITOR, American symbol
EXP = con-lstb:MA05-2: PIN HEADER; OC_FARNELL: unknown; OC_NEWARK: unknown
FB1 = rcl:L-US: INDUCTOR, American symbol
ICP = con-lstb:MA05-1: PIN HEADER; OC_FARNELL: unknown; OC_NEWARK: unknown
J1 J3 = con-harting-h:10H: CONNECTOR; OC_FARNELL: unknown; OC_NEWARK: unknown
J2 J4 = con-harting-ml:ML10: HARTING; OC_FARNELL: unknown; OC_NEWARK: unknown
J5 = con-harting-h:20H: CONNECTOR; OC_FARNELL: unknown; OC_NEWARK: unknown
J6 = con-harting-ml:ML20: HARTING; OC_FARNELL: unknown; OC_NEWARK: unknown
J7 = con-usb (1):USB: USB Connectors
J8 = con-rca-hsc:RCA-HSC
LED1 LED2 = led:LED: LED OSRAM: - CHIPLED LG R971, LG N971, LY N971, LG Q971, LY Q971, LO R971, LY R971 LH N974, LH R974 LS Q976, LO Q976, LY Q976 LO Q996 - Hyper CHIPLED LW Q18S LB Q993, LB Q99A, LB R99A - SideLED LS A670, LO A670, LY A670, LG A670, LP A670 LB A673, LV A673, LT A673, LW A673 LH A674 LY A675 LS A676, LA A676, LO A676, LY A676, LW A676 LS A679, LY A679, LG A679 - Hyper Micro SIDELED® LS Y876, LA Y876, LO Y876, LY Y876 LT Y87S - SmartLED LW L88C, LW L88S LB L89C, LB L89S, LG L890 LS L89K, LO L89K, LY L89K LS L896, LA L896, LO L896, LY L896 - TOPLED LS T670, LO T670, LY T670, LG T670, LP T670 LSG T670, LSP T670, LSY T670, LOP T670, LYG T670 LG T671, LOG T671, LSG T671 LB T673, LV T673, LT T673, LW T673 LH T674 LS T676, LA T676, LO T676, LY T676, LB T676, LH T676, LSB T676, LW T676 LB T67C, LV T67C, LT T67C, LS T67K, LO T67K, LY T67K, LW E67C LS E67B, LA E67B, LO E67B, LY E67B, LB E67C, LV E67C, LT E67C LW T67C LS T679, LY T679, LG T679 LS T770, LO T770, LY T770, LG T770, LP T770 LB T773, LV T773, LT T773, LW T773 LH T774 LS E675, LA E675, LY E675, LS T675 LS T776, LA T776, LO T776, LY T776, LB T776 LHGB T686 LT T68C, LB T68C - Hyper Mini TOPLED® LB M676 - Mini TOPLED Santana® LG M470 LS M47K, LO M47K, LY M47K Source: http://www.osram.convergy.de LUXEON: - LUMILED® LXK2-PW12-R00, LXK2-PW12-S00, LXK2-PW14-U00, LXK2-PW14-V00 LXK2-PM12-R00, LXK2-PM12-S00, LXK2-PM14-U00 LXK2-PE12-Q00, LXK2-PE12-R00, LXK2-PE12-S00, LXK2-PE14-T00, LXK2-PE14-U00 LXK2-PB12-K00, LXK2-PB12-L00, LXK2-PB12-M00, LXK2-PB14-N00, LXK2-PB14-P00, LXK2-PB14-Q00 LXK2-PR12-L00, LXK2-PR12-M00, LXK2-PR14-Q00, LXK2-PR14-R00 LXK2-PD12-Q00, LXK2-PD12-R00, LXK2-PD12-S00 LXK2-PH12-R00, LXK2-PH12-S00 LXK2-PL12-P00, LXK2-PL12-Q00, LXK2-PL12-R00 Source: www.luxeon.com KINGBRIGHT: KA-3528ASYC Source: www.kingbright.com; DKPN: 516-1429-1-ND
R1-R17 = rc-master-smd:R_: RESISTOR
U1 = DodoMicroR3:PIC32MX440F*H: Microchip PIC32 USB
U2 = 74xx-us:74*00: Quad 2-input NAND gate
U3A U3B = ns-linear:LM1881
U4 = maxim-10:MAX4390
U5B = TPS2041:TPS2041BDBV
VR1 = power:LINEAR-REG-SOT223
X1 = Nintendo:CTS-OSC

## Board
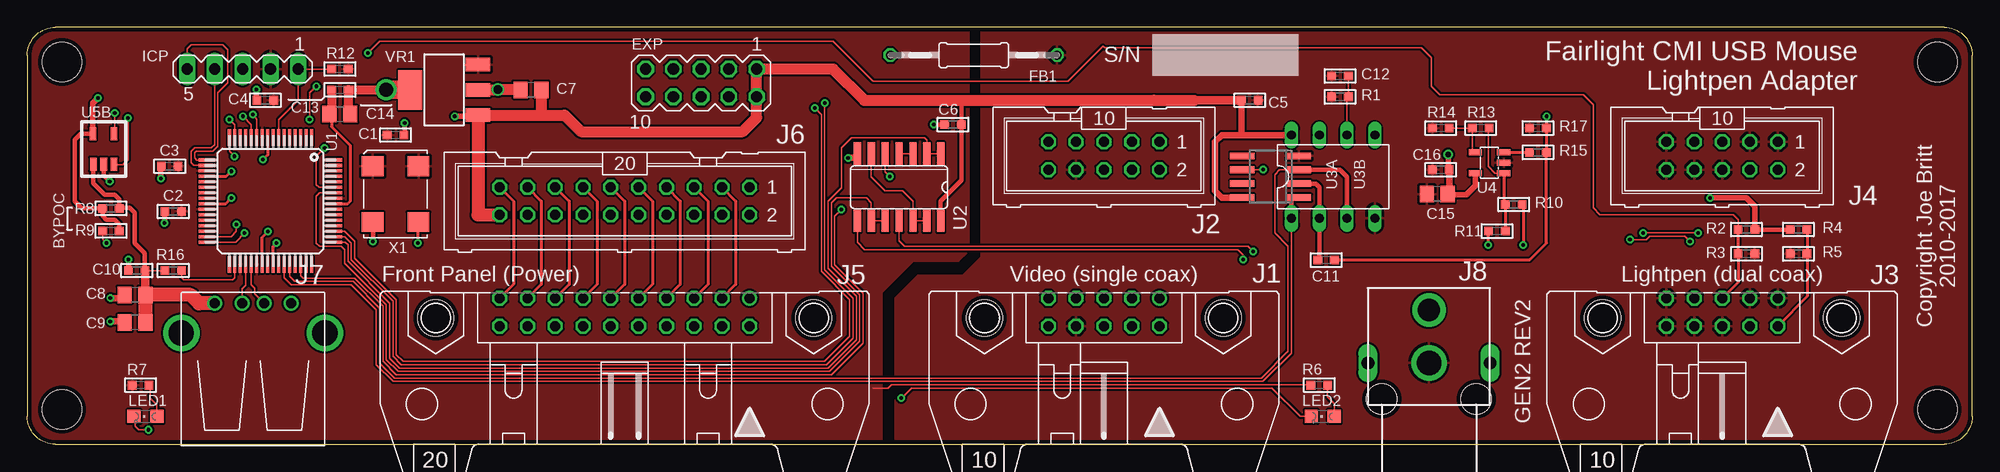
[diagram p6: board, top side]
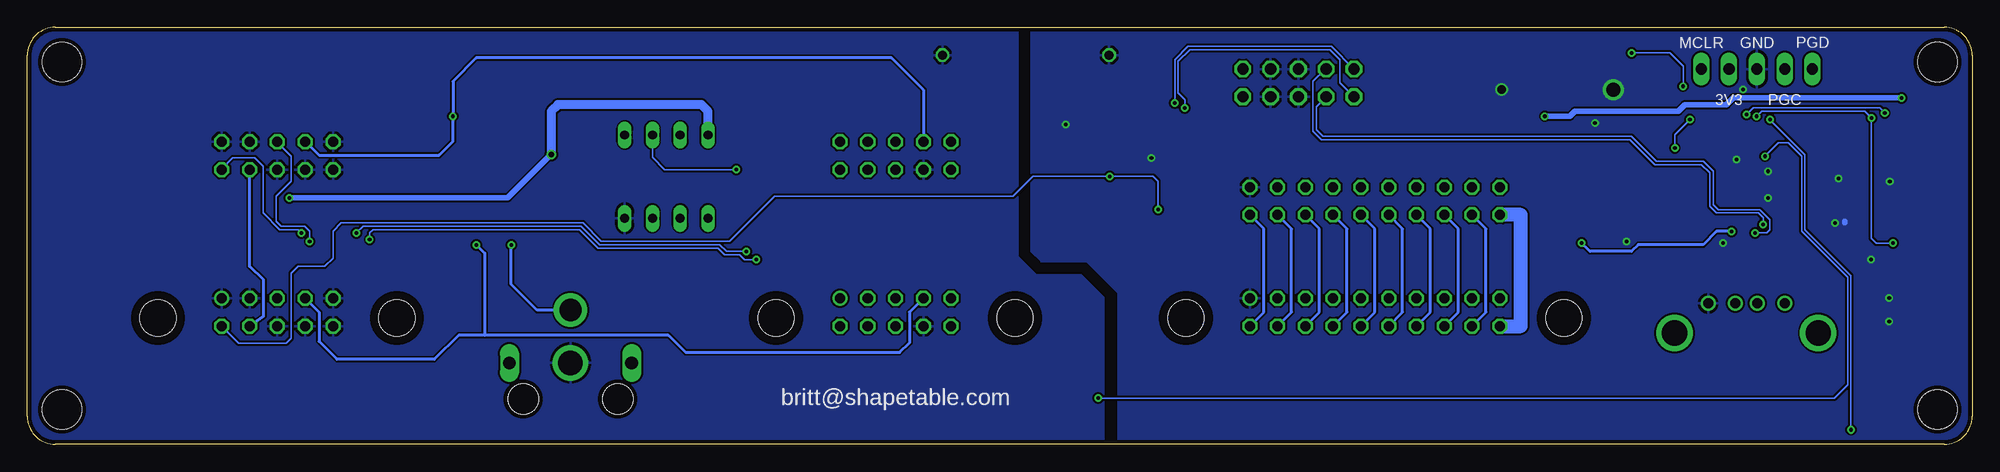
[diagram p7: board, bottom side, seen from below]

Size 177.8 x 38.1 mm. Coordinates in mm from the lower left corner, seen from the top.
Outline: 2.54,0 175.26,0 arc90 177.8,2.54 177.8,35.56 arc90 175.26,38.1 2.54,38.1 arc90 0,35.56 0,2.54 arc90 2.54,0
Copper layers (1*16): Top 0.0356mm / dielectric 1.5011mm / Bottom 0.0356mm
Design rules "LaenPCBOrder": minimum track width 6mil, minimum drill 13mil, track to track 6mil, track to pad 6mil, pad to pad 6mil, via to via 6mil, smd to smd 6mil, copper to edge 15mil, drill to drill 6mil, minimum pad ring 7mil, minimum via ring 7mil, stop-mask expansion 3mil, vias tented up to drill 0mil, thermal gap 10mil
Holes 3.58 mm at 174.62,34.92 174.62,3.17 3.17,3.17 3.17,34.92

### Footprints (pad centres in the part's own frame; a part is rotated, then mirrored left to right if it is on the bottom)
C0603 = smd 0.8 x 0.8: 1 -0.762,0; 2 0.762,0
C0805 = smd 1.3 x 1.5: 1 -0.95,0; 2 0.95,0
MA05-2 = drill 1.016 octagon: 1 -5.08,-1.27; 2 -5.08,1.27; 3 -2.54,-1.27; 4 -2.54,1.27; 5 0,-1.27; 6 0,1.27; 7 2.54,-1.27; 8 2.54,1.27; 9 5.08,-1.27; 10 5.08,1.27
0207/15 = drill 0.813 octagon: 1 -7.62,0; 2 7.62,0
MA05-1 = drill 1.016 long: 1 -5.08,0; 2 -2.54,0; 3 0,0; 4 2.54,0; 5 5.08,0
10H = drill 0.914: 1 -5.08,-1.27 | drill 0.914 octagon: 2 -5.08,1.27; 3 -2.54,-1.27; 4 -2.54,1.27; 5 0,-1.27; 6 0,1.27; 7 2.54,-1.27; 8 2.54,1.27; 9 5.08,-1.27; 10 5.08,1.27 | hole 3.302: -10.922,0.533; 10.922,0.533
ML10 = drill 0.914 octagon: 1 -5.08,-1.27; 2 -5.08,1.27; 3 -2.54,-1.27; 4 -2.54,1.27; 5 0,-1.27; 6 0,1.27; 7 2.54,-1.27; 8 2.54,1.27; 9 5.08,-1.27; 10 5.08,1.27
20H = drill 0.914: 1 -11.43,-1.27 | drill 0.914 octagon: 2 -11.43,1.27; 3 -8.89,-1.27; 4 -8.89,1.27; 5 -6.35,-1.27; 6 -6.35,1.27; 7 -3.81,-1.27; 8 -3.81,1.27; 9 -1.27,-1.27; 10 -1.27,1.27; 11 1.27,-1.27; 12 1.27,1.27; 13 3.81,-1.27; 14 3.81,1.27; 15 6.35,-1.27; 16 6.35,1.27; 17 8.89,-1.27; 18 8.89,1.27; 19 11.43,-1.27; 20 11.43,1.27 | hole 3.302: -17.272,0.533; 17.272,0.533
ML20 = drill 0.914 octagon: 1 -11.43,-1.27; 2 -11.43,1.27; 3 -8.89,-1.27; 4 -8.89,1.27; 5 -6.35,-1.27; 6 -6.35,1.27; 7 -3.81,-1.27; 8 -3.81,1.27; 9 -1.27,-1.27; 10 -1.27,1.27; 11 1.27,-1.27; 12 1.27,1.27; 13 3.81,-1.27; 14 3.81,1.27; 15 6.35,-1.27; 16 6.35,1.27; 17 8.89,-1.27; 18 8.89,1.27; 19 11.43,-1.27; 20 11.43,1.27
USB-A-H = drill 0.914: D+ 2.718,-1.003; D- 2.718,1.003; GND 2.718,-3.493; VBUS 2.718,3.493 | drill 2.311: P$5 0,-6.566; P$6 0,6.566
RCA-SHIELDED = drill 1.168 long: FRM1 6.858,11.176; FRM2 6.858,0 | drill 2.032: PIN 2.032,5.588 | drill 2.235: SHLD 6.858,5.588 | hole 2.794: 10.16,9.906; 10.16,1.27
CHIPLED_0805 = smd 1.2 x 1.2: A 0,-1.05; C 0,1.05
R0603 = smd 0.8 x 0.8: 1 -0.762,0; 2 0.762,0
TQFP64-10X10 = smd 1.5 x 0.28: 1 -5.8,3.75; 2 -5.8,3.25; 3 -5.8,2.75; 4 -5.8,2.25; 5 -5.8,1.75; 6 -5.8,1.25; 7 -5.8,0.75; 8 -5.8,0.25; 9 -5.8,-0.25; 10 -5.8,-0.75; 11 -5.8,-1.25; 12 -5.8,-1.75; 13 -5.8,-2.25; 14 -5.8,-2.75; 15 -5.8,-3.25; 16 -5.8,-3.75; 33 5.8,-3.75; 34 5.8,-3.25; 35 5.8,-2.75; 36 5.8,-2.25; 37 5.8,-1.75; 38 5.8,-1.25; 39 5.8,-0.75; 40 5.8,-0.25; 41 5.8,0.25; 42 5.8,0.75; 43 5.8,1.25; 44 5.8,1.75; 45 5.8,2.25; 46 5.8,2.75; 47 5.8,3.25; 48 5.8,3.75 | smd 0.28 x 1.5: 17 -3.75,-5.8; 18 -3.25,-5.8; 19 -2.75,-5.8; 20 -2.25,-5.8; 21 -1.75,-5.8; 22 -1.25,-5.8; 23 -0.75,-5.8; 24 -0.25,-5.8; 25 0.25,-5.8; 26 0.75,-5.8; 27 1.25,-5.8; 28 1.75,-5.8; 29 2.25,-5.8; 30 2.75,-5.8; 31 3.25,-5.8; 32 3.75,-5.8; 49 3.75,5.8; 50 3.25,5.8; 51 2.75,5.8; 52 2.25,5.8; 53 1.75,5.8; 54 1.25,5.8; 55 0.75,5.8; 56 0.25,5.8; 57 -0.25,5.8; 58 -0.75,5.8; 59 -1.25,5.8; 60 -1.75,5.8; 61 -2.25,5.8; 62 -2.75,5.8; 63 -3.25,5.8; 64 -3.75,5.8
SO14 = smd 0.66 x 2.032: 1 -3.81,-3.073; 2 -2.54,-3.073; 3 -1.27,-3.073; 4 0,-3.073; 5 1.27,-3.073; 6 2.54,-3.073; 7 3.81,-3.073; 8 3.81,3.073; 9 2.54,3.073; 10 1.27,3.073; 11 0,3.073; 12 -1.27,3.073; 13 -2.54,3.073; 14 -3.81,3.073
DIL08 = drill 0.813 long: 1 -3.81,-3.81; 2 -1.27,-3.81; 3 1.27,-3.81; 4 3.81,-3.81; 5 3.81,3.81; 6 1.27,3.81; 7 -1.27,3.81; 8 -3.81,3.81
SO08 = smd 0.6 x 2.2: 1 -1.905,-2.6; 2 -0.635,-2.6; 3 0.635,-2.6; 4 1.905,-2.6; 5 1.905,2.6; 6 0.635,2.6; 7 -0.635,2.6; 8 -1.905,2.6
SOT23-5L = smd 0.55 x 1.2: 1 -0.95,-1.3; 2 0,-1.3; 3 0.95,-1.3; 4 0.95,1.3; 5 -0.95,1.3
DBV-5 = smd 1.2 x 0.6: 1 -1.4,0.95; 2 -1.4,0; 3 -1.4,-0.95; 4 1.4,-0.95; 5 1.4,1
SOT-223 = smd 1.219 x 2.235: 1 -2.311,-3.099; 2 0,-3.099; 3 2.311,-3.099 | smd 3.6 x 2.2: 4 0,3.099
CTS-OSC = smd 1.8 x 2: 1 -2.55,-2.1; 2 2.55,-2.1; 3 2.55,2.1; 4 -2.55,2.1

### Placement (x,y rotation side)
C1  33.66,28.26 0 top
C2  13.33,21.27 180 top
C3  13.02,25.4 180 top
C4  21.75,31.43 180 top
C5  111.76,31.43 0 top
C6  84.61,29.21 180 top
C7  46.04,32.38 180 top
C8  9.84,13.65 180 top
C9  9.84,11.11 180 top
C10  10,15.88 180 top
C11  118.75,16.83 180 top
C12  120.01,33.65 180 top
C13  28.57,32.38 0 top
C14  28.57,30.16 0 top
C15  128.91,22.86 180 top
C16  129.22,25.08 0 top
EXP  61.59,33.02 180 top
FB1  86.52,35.56 180 top
ICP  19.68,34.29 180 top
J1  98.42,12.06 180 top
J2  98.42,26.35 180 top
J3  154.94,12.06 180 top
J4  154.94,26.35 180 top
J5  54.61,12.06 180 top
J6  54.61,22.22 180 top
J7  20.64,10.16 90 top
J8  122.56,14.29 270 top
LED1  10.79,2.54 90 top
LED2  118.43,2.54 90 top
R1  120.01,31.75 0 top
R2  157.16,19.62 0 top
R3  157.16,17.4 180 top
R4  161.92,19.62 180 top
R5  161.92,17.4 0 top
R6  118.11,5.4 180 top
R7  10.35,5.4 180 top
R8  7.65,21.55 0 top
R9  7.65,19.49 180 top
R10  135.89,21.91 180 top
R11  134.37,19.48 0 top
R12  28.57,34.29 0 top
R13  132.88,28.89 180 top
R14  129.22,28.89 180 top
R15  138.11,26.67 0 top
R16  13.33,15.88 0 top
R17  138.11,28.89 180 top
U1  22.22,22.22 270 top
U2  79.69,23.49 180 top
U3A  119.38,24.45 0 top
U3B  113.66,24.45 90 top
U4  133.67,25.72 90 top
U5B  6.98,26.99 90 top
VR1  38.1,32.38 90 top
X1  33.66,22.86 270 top

### Tracks (layer width: path | path; a pad name or v marks a point on that pad's centre or on a via)
3V3
  Top 0.152: R6.2 117.31,5.44 78.99,5.44 78.69,5.13 77.32,5.13
  pour Top (isolate 0.178): 86.04,38.1 86.04,17.65 85.09,16.7 80.96,16.7 78.1,13.84 78.1,0 0,0 0,38.1
5V0_FILT  (via drill 0.33, 0.51)
  Top 0.406: U2.14 83.5,22.22 85.41,24.13 85.41,29.08 C6.1 85.41,29.34 85.41,31.43 | R2.2 R4.2 | R9.1 8.41,20.1 7.99,20.52 7.23,20.52 6.88,20.87 R8.1 4.98,21.55 4.33,22.2 4.33,27.84 4.88,28.39 U5B.5
  Top 0.508: U5B.5 5.98,31.17 v6.46,31.65 | v39.06,29.97 41,29.97 VR1.1 | U4.5 132.37,23.6 131.57,22.81 129.91,22.81 C15.1 | v129.9,26.48 129.9,24.85 C16.2 | R2.2 157.92,21.75 157.17,22.5 v153.82,22.5
  Top 0.61: C16.2 129.98,22.86 C15.1 | U3B.8 109.22,22.54 108.58,23.18 108.58,27.62 109.22,28.26 111,28.26 | 111,28.26 U3A.8 | 111,28.26 C5.1
  Top 0.762: 103,31.56 102.87,31.43 | C5.1 106.68,31.43
  Top 1.016: VR1.1 46.99,30.07 | 46.99,30.07 49.11,30.07 50.61,28.57 65.41,28.57 66.67,29.84 EXP.2 EXP.1 73.66,34.29 76.52,31.43 85.41,31.43 102.87,31.43 106.68,31.43 | C7.1 46.99,30.07
  Top 1.194: VR1.1 41.2,20.95 J6.20
  Bottom 0.508: v39.06,29.97 36.78,29.97 36.32,30.43 26.87,30.43 26.26,31.04 22.45,31.04 21.84,31.65 v6.46,31.65 | v153.82,22.5 133.87,22.5 v129.9,26.48
  Bottom 0.813: U3A.8 115.57,30.43 116.18,31.04 129.29,31.04 129.9,30.43 v129.9,26.48
  Bottom 1.27: J5.20 41.27,10.79 41.27,20.95 J6.20
/MOUSE_VBUS_EN  (via drill 0.33)
  Top 0.152: U5B.4 7.98,28.35 v7.99,30.28 | v20.62,30.12 20.97,29.71 U1.11
  Bottom 0.152: v7.99,30.28 8.45,30.73 20.01,30.73 v20.62,30.12
/MOUSE_VBUS_OC  (via drill 0.33)
  Top 0.152: v9.21,29.82 9.21,26.01 8.73,25.54 7.99,25.54 arc-90 U5B.3 | v19.71,29.97 20.47,29.21 U1.12 | R9.2 6.88,18.73 v7.23,18.39
  Bottom 0.152: v19.71,29.97 19.25,30.43 9.82,30.43 v9.21,29.82 9.21,18.85 8.75,18.39 v7.23,18.39
COMP_SYNC
  Top 0.152: U3A.1 115.57,8.33 112.98,5.74 33.43,5.74 31.9,7.26 31.9,12.29 29.62,14.58 24.13,14.58 23.47,15.23 U1.43
  Top 0.406: U3A.1 115.57,22.54 U3B.1
EXM_PMA8_SCL2_CN18_U2TX_RF5  (via drill 0.33)
  Top 0.152: U1.32 19.03,18.47 v19.86,19.3
  Bottom 0.152: v19.86,19.3 18.8,19.3 18.49,19.61 18.49,20.52 19.41,21.44 23.22,21.44 23.67,21.89 23.67,24.94 24.59,25.86 28.85,25.86 31.14,28.14 59.33,28.14 59.94,28.75 59.94,30.86 EXP.8
EXM_PMA9_SDA2_CN17_U2RX_RF4  (via drill 0.33)
  Top 0.152: v19.1,20.07 19.1,19.46 18.62,18.97 U1.31
  Bottom 0.152: EXP.7 59.13,34.29 60.25,33.17 60.25,28.6 59.49,27.84 31.29,27.84 29.01,25.55 24.74,25.55 23.98,24.79 23.98,21.74 23.37,21.13 19.56,21.13 19.1,20.68 v19.1,20.07
EXM_RB0_AN0_CN2_PMA6  (via drill 0.33)
  Top 0.152: LED2.C 116.38,2.54 113.79,5.13 80.82,5.13 v79.91,4.22 | v18.95,26.31 18.49,26.77 18.49,28.01 U1.16
  Bottom 0.152: v79.91,4.22 12.61,4.22 11.39,5.44 11.39,15.25 15.6,19.46 15.6,26.31 16.81,27.53 17.73,27.53 v18.95,26.31
EXM_RD2_OC3_U1RX  (via drill 0.33)
  Top 0.152: U1.50 29.03,18.97 29.62,18.39 29.62,16.87 33.43,13.06 33.43,8.03 34.19,7.26 73.05,7.26 75.49,9.7 75.49,13.36 72.9,15.95 v72.9,31.19
  Bottom 0.152: v72.9,31.19 72.9,35.15 71.68,36.37 58.6,36.37 EXP.9
EXM_RD3_OC4_U1TX  (via drill 0.33)
  Top 0.152: U1.51 28.99,19.47 29.92,18.54 29.92,17.02 33.73,13.21 33.73,8.18 34.34,7.57 72.9,7.57 75.18,9.85 75.18,13.21 72.59,15.8 72.59,30.12 v71.98,30.73
  Bottom 0.152: v71.98,30.73 71.98,31.5 72.59,32.11 72.59,35 71.53,36.07 58.72,36.07 57.81,35.15 57.81,33.04 EXP.10
GND  (via drill 0.33, 0.76, 1.27)
  Top 0.254: U1.41 22.47,18.06 v22.76,18.39 | U1.25 18.11,21.97 v18.64,22.5 | U1.20 18.18,24.47 v18.64,24.94 | U1.9 21.97,26.44 v21.54,26.01
  Top 0.406: v31.6,18.54 31.6,20.27 X1.2 | U5B.2 6.98,24.57 v7.53,24.03 | C6.2 v82.87,29.21 | v34.49,29.36 34.49,28.33 C1.2
  Top 0.508: C10.2 9.16,15.95 9.26,16.05 v9.26,16.87 | C3.2 12.2,25.35 v12.2,24.29 | C2.2 12.55,21.27 v12.55,20.22 | C4.2 20.93,31.43 v20.93,32.41
  Top 0.61: U2.7 75.88,26.16 v75.03,26.16 | C8.2 8.6,13.36 v7.58,13.36 | C9.2 8.78,11.23 v7.58,11.23
  Top 0.813: v32.82,32.41 29.36,32.41 C13.2 29.34,30.16 C14.2
  Top 1.016: VR1.2 41.22,32.41 v43.03,32.41 45.06,32.41 C7.2
  Top 1.676: VR1.4 34.98,32.41 v32.82,32.41
  Bottom 0.508: 11.63,20.37 11.63,20.22
  pour Bottom (isolate 0.178, rank 6): 0,38.1 86.04,38.1 86.04,17.65 85.09,16.7 80.96,16.7 78.1,13.84 78.1,0 0,0
LP_HIT_FROM_PEN  (via drill 0.33)
  Top 0.152: U2.5 78.42,24.9 v78.84,24.49 | v74.42,21.44 73.81,20.83 73.81,16.41 76.4,13.82 76.4,9.25 73.51,6.35 33.73,6.35 32.51,7.57 32.51,12.6 29.92,15.19 25.2,15.19 24.97,15.41 U1.46
  Top 0.254: R4.1 162.56,19.62 162.75,19.43 162.75,17.34 | 162.75,17.34 R5.2 | 162.75,17.34 162.75,13.53 J3.2
  Bottom 0.152: v74.42,21.44 74.42,24.03 74.88,24.49 v78.84,24.49 85.85,24.49 87.68,22.66 109.47,22.66 113.59,18.54 125.32,18.54 127,20.22 149.1,20.22 149.86,19.46 149.86,17.02 150.62,16.26 153.06,16.26 153.67,15.65 153.67,9.7 154.13,9.25 158.47,9.25 J3.2
LP_HIT_TO_CMI  (via drill 0.33)
  Top 0.152: U2.11 79.69,18.6 80.21,18.08 111.61,18.08 v112.06,17.63 | v147.73,19.3 v152.76,19.3
  Bottom 0.152: v112.06,17.63 113.89,17.63 114.5,18.24 125.48,18.24 127.15,19.91 147.12,19.91 v147.73,19.3 | v152.76,19.3 153.06,19.61 154.74,19.61 156.26,21.13 156.26,25.4 157.02,26.16 159,26.16 160.02,25.15 J4.2
LP_TOUCH_FROM_PEN  (via drill 0.33)
  Top 0.152: U1.59 26.66,23.47 26.42,23.72 26.42,26.31 v27.18,27.08 | v25.81,29.67 25.81,32.11 v26.42,32.71 | v31.14,35.76 32.21,36.83 73.66,36.83 77.32,33.17 95.15,33.17 98.35,36.37 98.5,36.22 127.46,36.22 128.37,35.31 128.37,32.71 129.13,31.95 142.24,31.95 143.15,31.04 143.15,21.59 143.76,20.98 155.96,20.98 156.41,20.52 156.41,19.63 R2.1
  Top 0.254: R2.1 R3.2 156.4,14.79 J3.5
  Bottom 0.152: v26.42,32.71 26.42,34.54 27.63,35.76 v31.14,35.76 | v25.81,29.67 27.18,28.3 v27.18,27.08
LP_TOUCH_TO_CMI  (via drill 0.33)
  Top 0.152: U2.8 75.88,18.45 76.56,17.78 110.69,17.78 111.15,17.32 v111.15,16.87 | v146.51,18.69 148.03,18.69 148.34,19 151.54,19 v151.99,18.54
  Bottom 0.152: v111.15,16.87 112.22,16.87 112.67,17.32 114.05,17.32 114.66,17.93 125.63,17.93 127.31,19.61 146.2,19.61 146.51,19.3 v146.51,18.69 | v151.99,18.54 151.99,19.46 152.45,19.91 154.58,19.91 155.04,20.37 155.04,22.66 153.67,24.03 153.67,26.31 154.94,27.58 J4.5
MOUSE_D+
  Top 0.152: U1.37 20.47,14.58 20.78,14.27 20.78,13.74 J7.D+
MOUSE_D-
  Top 0.152: U1.36 19.97,14.54 19.63,14.2 J7.D-
MOUSE_VBUS
  Top 0.152: R16.1 C10.1
  Top 0.406: U5B.1 6.03,23.85 7.07,22.81 7.99,22.81 8.41,22.39 R8.2 8.45,21.59 9.35,21.59 9.8,21.13 9.8,18.39 10.72,17.47 10.72,15.92 C10.1 10.78,15.89
  Top 0.762: C10.1 10.76,13.68
  Top 0.813: 10.76,13.68 C8.1
  Top 1.27: J7.VBUS 15.7,12.88 14.92,13.65 C8.1 C9.1
N$1
  Top 0.254: 27.81,30.16 27.81,29.02 29.53,27.3 29.53,22.22 29.28,21.97 U1.56
  Top 0.813: C13.1 27.81,30.16 C14.1
N$2
  Top 0.152: R6.1 118.87,4.32 119.48,3.71 LED2.A
N$3
  Bottom 0.254: J3.4 156.21,11.68 156.21,15.05 157.48,16.26 J4.4
N$4
  Top 0.406: C11.2 118.11,17.14 U3A.2 118.11,23.49 117.79,23.81 U3B.2
N$5  (via drill 0.33)
  Top 0.152: 18.8,29.36 v18.49,29.67 18.97,29.18 U1.15 | LED1.C 9.87,2.42 9.87,1.63 10.17,1.32 v11.09,1.32
  Bottom 0.152: v11.09,1.32 11.09,15.4 15.29,19.61 15.29,26.47 v18.49,29.67
N$6  (via drill 0.33)
  Top 0.152: U3A.6 120.65,31.62 R1.2 C12.1 | U3B.6 111.92,25.08 v112.98,25.09
  Bottom 0.152: v112.98,25.09 119.53,25.09 120.65,26.21 U3A.6
N$7
  Bottom 0.254: J5.18 44.45,12.06 44.45,19.68 J6.18
N$8
  Bottom 0.254: J5.16 46.99,12.06 46.99,19.68 J6.16
N$9
  Bottom 0.254: J5.14 49.53,12.06 49.53,19.68 J6.14
N$10
  Bottom 0.254: J5.12 52.07,12.06 52.07,19.68 J6.12
N$11
  Bottom 0.254: J5.10 54.61,12.06 54.61,19.68 J6.10
N$12
  Bottom 0.254: J5.8 57.15,12.06 57.15,19.68 J6.8
N$13
  Bottom 0.254: J5.6 59.69,12.06 59.69,19.68 J6.6
N$14
  Bottom 0.254: J5.4 62.23,12.06 62.23,19.68 J6.4
N$15
  Bottom 0.254: J5.2 64.77,12.06 64.77,19.68 J6.2
N$16  (via drill 0.33)
  Top 0.254: U1.39 21.47,18.93 v22,19.46 | v35.71,18.39 35.71,20.27 X1.3
  Bottom 0.254: v22,19.46 23.37,19.46 24.59,18.24 30.53,18.24 31.14,17.63 34.95,17.63 35.1,17.78 v35.71,18.39
N$17
  Top 0.152: R13.1 133.55,28.96 133.55,25.4 134.19,24.77 U4.1 | 134.97,22.07 R10.2
  Top 0.254: U4.1 134.97,22.07 | R10.2 R11.2
N$18
  Top 0.254: J6.3 64.77,22.22 64.77,14.6 J5.3
N$19
  Top 0.254: J6.5 62.23,22.22 62.23,14.6 J5.5
N$20
  Top 0.254: J6.7 59.69,22.22 59.69,14.6 J5.7
N$21
  Top 0.254: J6.9 57.15,22.22 57.15,14.6 J5.9
N$22
  Top 0.254: J6.11 54.61,22.22 54.61,14.6 J5.11
N$23
  Top 0.254: J6.13 52.07,22.22 52.07,14.6 J5.13
N$24
  Top 0.254: J6.15 49.53,22.22 49.53,14.6 J5.15
N$27
  Top 0.152: U2.10 U2.9 77.15,22.06 76.71,22.5 73.97,22.5 73.51,22.05 73.51,16.26 76.1,13.66 76.1,9.4 73.35,6.65 33.88,6.65 32.82,7.72 32.82,12.75 29.01,16.56 29.01,17.78 28.7,18.08 26.72,18.08 26.42,18.39 26.42,22.66 26.72,22.96 28.01,22.96 U1.58
N$28
  Top 0.254: J6.17 46.99,22.22 46.99,14.6 J5.17
N$29
  Top 0.152: U2.6 77.15,24.45 78.42,23.18 80.01,23.18 80.96,22.22 U2.12 U2.13
N$30
  Top 0.152: U2.4 U2.3
N$31
  Top 0.152: U2.1 U2.2 82.23,27.8 82.04,27.99 75.34,27.99 74.42,27.08 74.42,23.42 73.2,22.2 73.2,16.1 75.79,13.51 75.79,9.55 73.2,6.96 34.04,6.96 33.12,7.87 33.12,12.9 29.31,16.71 29.31,18.24 29.07,18.47 U1.49
N$32
  Top 0.254: J6.19 44.45,22.22 44.45,14.6 J5.19
N$33  (via drill 0.33)
  Top 0.152: 133.55,19.43 R11.1
  Top 0.254: v133.55,18.2 133.55,19.43
  Bottom 0.254: J8.PIN 131.19,12.26 133.55,14.62 v133.55,18.2
N$34
  Top 0.152: R7.1 11.24,5.51 11.24,4.22 11.84,3.61 LED1.A
N$35
  Top 0.152: U4.4 132.12,26.77 R13.2 R14.1
N$36
  Top 0.152: U1.34 18.97,15.22 18.8,15.04 14.29,15.04 14.1,15.23 R16.2
N$37
  Top 0.152: U4.3
  Top 0.254: U4.3 R15.1
PGC
  Top 0.152: ICP.5 14.6,36.14 14.99,36.52 17.88,36.52 18.34,36.07 18.34,33.02 17.42,32.11 17.42,27.23 16.97,26.77 15.44,26.77 15.29,26.62 15.29,26.16 15.48,25.97 U1.17
PGD
  Top 0.152: U1.18 15.22,25.47 14.99,25.7 14.99,26.77 15.29,27.08 16.81,27.08 17.12,27.38 17.12,34.27 ICP.4
U2_MCLR
  Top 0.152: R12.1 ICP.1 24.76,31.43 22.97,29.64 U1.7
VDU_VIDEO  (via drill 0.33)
  Top 0.254: R10.1 136.75,21.81 v136.75,18.2
  Bottom 0.254: 135.99,9.96 119.18,9.96 117.6,8.38 98.04,8.38 97.16,9.27 97.16,12.06 J1.7 | v136.75,18.2 136.72,18.2 135.99,17.47 135.99,9.96 | 135.99,9.96 138.38,9.96 140.59,7.75 149.48,7.75 151.13,9.4 151.13,12.06 J3.7
VIDEO  (via drill 0.33)
  Top 0.152: 138.98,26.77 R15.2 138.89,26.66 | 138.89,28.9 R17.1 | 119.63,16.87 C11.1
  Top 0.254: R17.1 R15.2 | v138.89,29.97 138.89,28.9 | 119.63,16.87 137.36,16.87 138.89,18.39 138.89,26.66
  Bottom 0.254: J2.7 95.88,32.38 98.81,35.31 136.75,35.31 138.89,33.17 v138.89,29.97 138.89,27.69 140.16,26.42 151.13,26.42 152.34,27.62 J4.7
VIDEO_GND
  pour Bottom (isolate 0.178): 87.25,38.1 177.8,38.1 177.8,0 79.38,0 79.38,13.4 81.41,15.43 85.53,15.43 87.25,17.14
  pour Top (isolate 0.178): 79.38,0 79.38,13.4 81.41,15.43 85.53,15.43 87.25,17.14 87.25,38.1 177.8,38.1 177.8,0
VSYNC
  Top 0.152: U3B.3 114.49,25.08 114.05,24.64 114.05,19.3 115.26,18.08 115.26,8.48 112.83,6.04 33.58,6.04 32.21,7.42 32.21,12.45 29.77,14.88 24.43,14.88 23.98,15.34 U1.44
  Top 0.406: U3B.3 120.01,25.08 120.65,24.45 U3A.3

### Text on the board
tPlace: S/N | Fairlight CMI USB Mouse / Lightpen Adapter | OC | BYP | Copyright Joe Britt / 2010-2017 | Front Panel (Power) | Video (single coax) | Lightpen (dual coax) | GEN2 REV2
bPlace: PGD | GND | MCLR | PGC | 3V3 | britt@shapetable.com